# EAGLE schematic stm32_02 - Stijn (EAGLE 9.5.1)

## Sheet 1 of 4: POWER
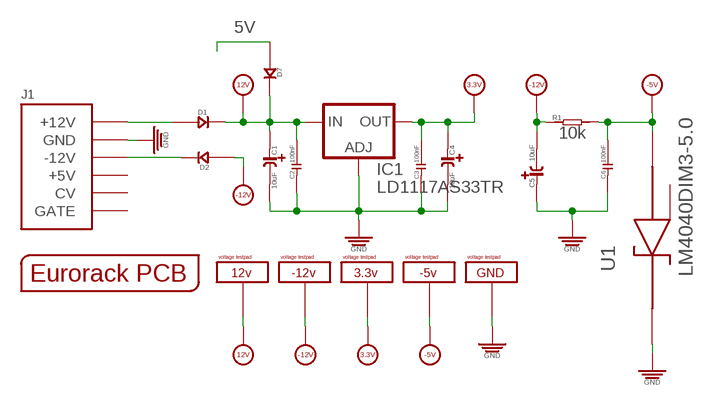
[diagram p0: schematic, sheet 1]

### Parts
C1  10uF  C-POLAR-A  [CASE-A_3216]
C2  100nF  C-0603  [C0603]
C3  100nF  C-0603  [C0603]
C4  10uF  C-POLAR-A  [CASE-A_3216]
C5  10uF  C-POLAR-A  [CASE-A_3216]
C6  100nF  C-0603  [C0603]
D1  D-SMA  [DO-214AC]
D2  D-SMA  [DO-214AC]
D7  D-SMA  [DO-214AC]
IC1  LD1117AS33TR  [SOT223]
J1  POWERSHROUDED  [POWER_16_SHROUDED]
PCB1  EURORACK_PCB12HP  [EURORACK12HPPCB]
R1  10k  R-0603  [R0603]
U1  LM4040DIM3-5.0  [SOT95P237X112-3N]
U$7  VOLTAGETESTPAD  [POWERTESTPAD]
U$8  VOLTAGETESTPAD  [POWERTESTPAD]
U$37  VOLTAGETESTPAD  [POWERTESTPAD]
U$38  VOLTAGETESTPAD  [POWERTESTPAD]
U$43  VOLTAGETESTPAD  [POWERTESTPAD]

### Nets
3.3V [POWER]: C3.2 C4.+ IC1.2(OUT) IC1.4(OUT) U$37.P$1(VOLTAGE) U$37.P$2(VOLTAGE) U$37.P$3(VOLTAGE) ; also sheet 2,3,4
5V: D7.1(+) ; also sheet 2
12V [POWER]: C1.+ C2.2 D1.2(-) D7.2(-) IC1.3(IN) U$7.P$1(VOLTAGE) U$7.P$2(VOLTAGE) U$7.P$3(VOLTAGE) ; also sheet 4
-5V [POWER]: C6.2 R1.2 U1.2(ANODE) U$38.P$1(VOLTAGE) U$38.P$2(VOLTAGE) U$38.P$3(VOLTAGE) ; also sheet 3,4
-12V [POWER]: C5.- D2.1(+) R1.1 U$8.P$1(VOLTAGE) U$8.P$2(VOLTAGE) U$8.P$3(VOLTAGE) ; also sheet 4
GND [POWER]: C1.- C2.1 C3.1 C4.- C5.+ C6.1 IC1.1(ADJ) J1.3(GND) J1.4(GND) J1.5(GND) J1.6(GND) J1.7(GND) J1.8(GND) U1.1(CATHODE) U$43.P$1(VOLTAGE) U$43.P$2(VOLTAGE) U$43.P$3(VOLTAGE) ; also sheet 2,3,4
N$1: D2.2(-) J1.1(-12V) J1.2(-12V)
N$2: D1.1(+) J1.9(+12V) J1.10(+12V)
Unconnected: J1.11(+5V) J1.12(+5V) J1.13(CV) J1.14(CV) J1.15(GATE) J1.16(GATE) U1.3(NC)

## Sheet 2 of 4: STM
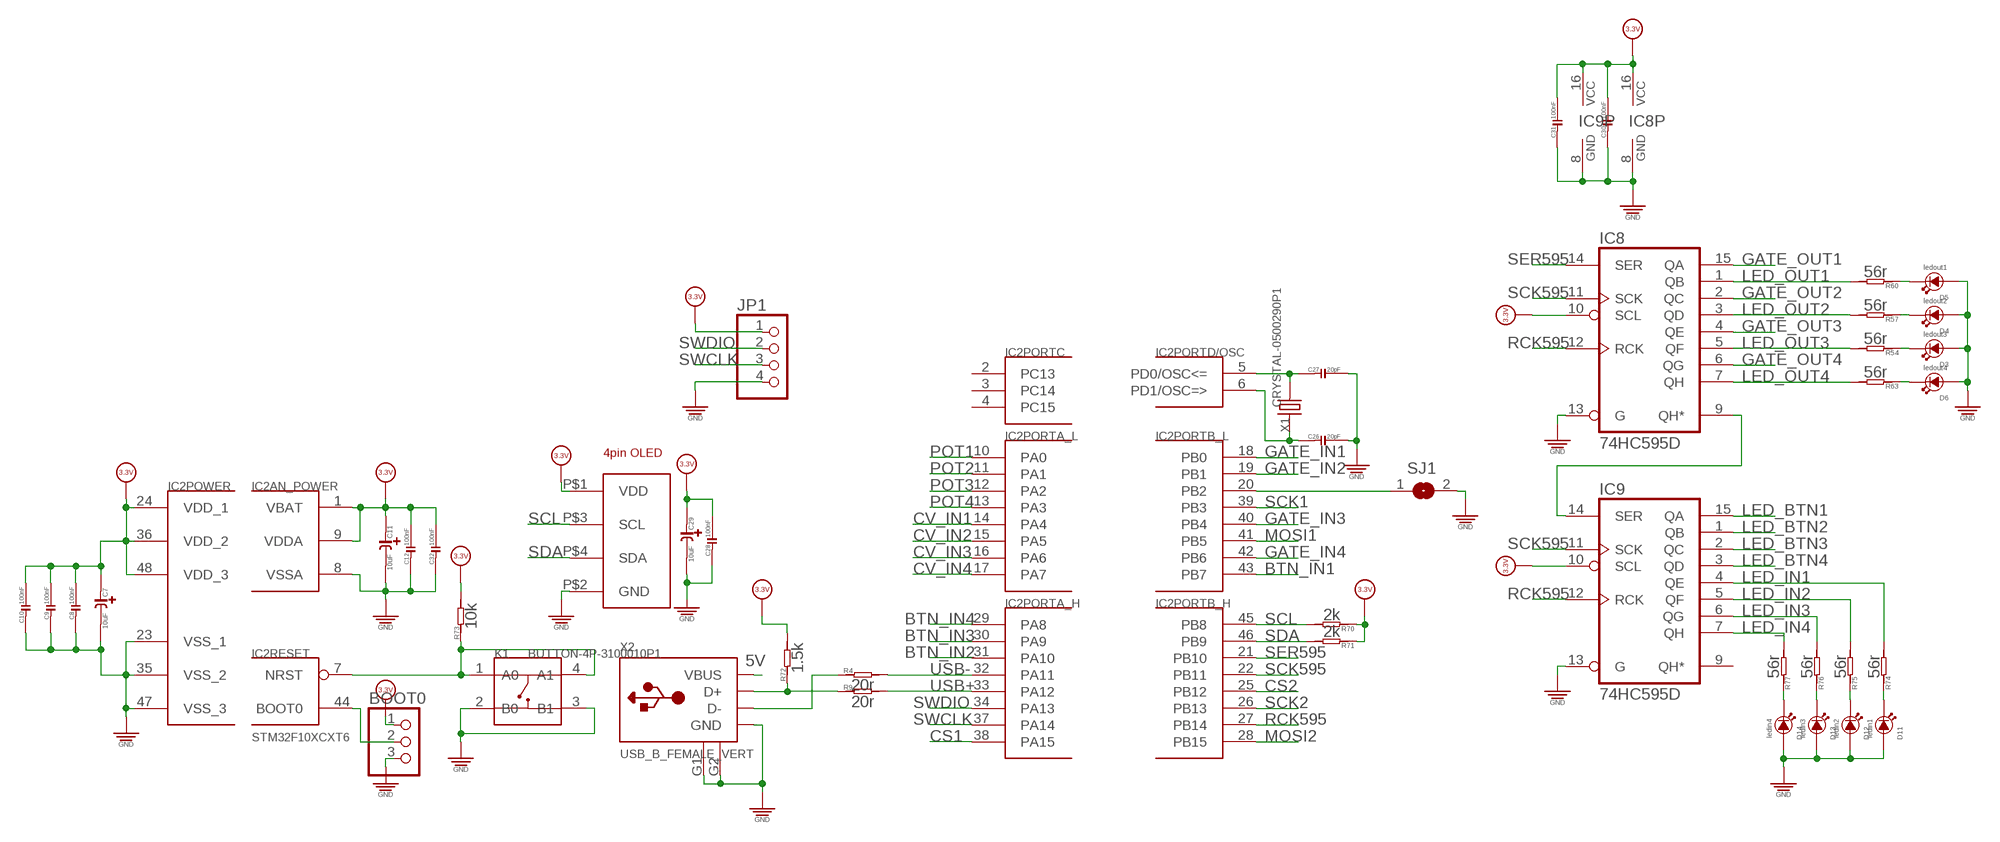
[diagram p1: schematic, sheet 2]

### Parts
BOOT0  PINHD-1X3  [1X03]
C7  10uF  C-POLAR-A  [CASE-A_3216]
C8  100nF  C-0603  [C0603]
C9  100nF  C-0603  [C0603]
C10  100nF  C-0603  [C0603]
C11  10uF  C-POLAR-A  [CASE-A_3216]
C12  100nF  C-0603  [C0603]
C26  20pF  C-0603  [C0603]
C27  20pF  C-0603  [C0603]
C28  100nF  C-0603  [C0603]
C29  10uF  C-POLAR-A  [CASE-A_3216]
C30  100nF  C-0603  [C0603]
C31  100nF  C-0603  [C0603]
C32  100nF  C-0603  [C0603]
D3  LED3MM  [3MMLED]
D4  LED3MM  [3MMLED]
D5  LED3MM  [3MMLED]
D6  LED3MM  [3MMLED]
D11  LED3MM  [3MMLED]
D12  LED3MM  [3MMLED]
D13  LED3MM  [3MMLED]
D14  LED3MM  [3MMLED]
IC2  STM32F10XCXT6  [TQFP48]
IC8  74HC595D  [SO16]
IC9  74HC595D  [SO16]
JP1  PINHD-1X4  [1X04]
K1  BUTTON-4P-3100010P1  [4P-SMD-6.0X6.0X5.0H]
R4  20r  R-0603  [R0603]
R9  20r  R-0603  [R0603]
R54  56r  R-0603  [R0603]
R57  56r  R-0603  [R0603]
R60  56r  R-0603  [R0603]
R63  56r  R-0603  [R0603]
R70  2k  R-0603  [R0603]
R71  2k  R-0603  [R0603]
R72  1.5k  R-0603  [R0603]
R73  10k  R-0603  [R0603]
R74  56r  R-0603  [R0603]
R75  56r  R-0603  [R0603]
R76  56r  R-0603  [R0603]
R77  56r  R-0603  [R0603]
SJ1  SJ  [SJ]
U$44  4PIN_OLED  [1.3_4PIN_OLED]
X1  CRYSTAL-0500290P1  [2P-SMD-5.0X3.2]
X2  USB_B_FEMALE_VERT  [USB_B_VERT]

### Nets
3.3V [POWER]: BOOT0.1 C7.+ C8.2 C9.2 C10.2 C11.+ C12.2 C28.2 C29.+ C30.2 C31.2 C32.2 IC2.1(AN_POWER:VBAT) IC2.9(AN_POWER:VDDA) IC2.24(POWER:VDD_1) IC2.36(POWER:VDD_2) IC2.48(POWER:VDD_3) IC8.10(SCL) IC8.16(VCC) IC9.10(SCL) IC9.16(VCC) JP1.1 R70.1 R71.1 R72.2 R73.2 U$44.P$1(VDD) ; also sheet 1,3,4
5V: X2.1(VBUS) ; also sheet 1
BTN_IN1: IC2.43(PORTB_L:PB7) ; also sheet 3
BTN_IN2: IC2.31(PORTA_H:PA10) ; also sheet 3
BTN_IN3: IC2.30(PORTA_H:PA9) ; also sheet 3
BTN_IN4: IC2.29(PORTA_H:PA8) ; also sheet 3
CS1: IC2.38(PORTA_H:PA15) ; also sheet 4
CS2: IC2.25(PORTB_H:PB12) ; also sheet 4
CV_IN1: IC2.14(PORTA_L:PA4) ; also sheet 3
CV_IN2: IC2.15(PORTA_L:PA5) ; also sheet 3
CV_IN3: IC2.16(PORTA_L:PA6) ; also sheet 3
CV_IN4: IC2.17(PORTA_L:PA7) ; also sheet 3
GATE_IN1: IC2.18(PORTB_L:PB0) ; also sheet 3
GATE_IN2: IC2.19(PORTB_L:PB1) ; also sheet 3
GATE_IN3: IC2.40(PORTB_L:PB4) ; also sheet 3
GATE_IN4: IC2.42(PORTB_L:PB6) ; also sheet 3
GATE_OUT1: IC8.15(QA) ; also sheet 4
GATE_OUT2: IC8.2(QC) ; also sheet 4
GATE_OUT3: IC8.4(QE) ; also sheet 4
GATE_OUT4: IC8.6(QG) ; also sheet 4
GND [POWER]: BOOT0.3 C7.- C8.1 C9.1 C10.1 C11.- C12.1 C26.2 C27.2 C28.1 C29.- C30.1 C31.1 C32.1 D3.+ D4.+ D5.+ D6.+ D11.+ D12.+ D13.+ D14.+ IC2.8(AN_POWER:VSSA) IC2.23(POWER:VSS_1) IC2.35(POWER:VSS_2) IC2.47(POWER:VSS_3) IC8.8(GND) IC8.13(G) IC9.8(GND) IC9.13(G) JP1.4 K1.2(B0) K1.3(B1) SJ1.2 U$44.P$2(GND) X2.4(GND) X2.G1(GND1) X2.G2(GND2) ; also sheet 1,3,4
LED_BTN1: IC9.15(QA) ; also sheet 3
LED_BTN2: IC9.1(QB) ; also sheet 3
LED_BTN3: IC9.2(QC) ; also sheet 3
LED_BTN4: IC9.3(QD) ; also sheet 3
LED_IN1: IC9.4(QE) R74.2
LED_IN2: IC9.5(QF) R75.2
LED_IN3: IC9.6(QG) R76.2
LED_IN4: IC9.7(QH) R77.2
LED_OUT1: IC8.1(QB) R60.2
LED_OUT2: IC8.3(QD) R57.2
LED_OUT3: IC8.5(QF) R54.2
LED_OUT4: IC8.7(QH) R63.2
MOSI1: IC2.41(PORTB_L:PB5) ; also sheet 4
MOSI2: IC2.28(PORTB_H:PB15) ; also sheet 4
N$51: D3.- R54.1
N$56: IC2.32(PORTA_H:PA11) R4.2
N$59: D6.- R63.1
N$60: IC2.33(PORTA_H:PA12) R9.2
N$63: C27.1 IC2.5(PORTD/OSC:PD0/OSC<=) X1.2
N$64: C26.1 IC2.6(PORTD/OSC:PD1/OSC=>) X1.1
N$65: D4.- R57.1
N$67: D5.- R60.1
N$77: IC2.20(PORTB_L:PB2) SJ1.1
N$78: BOOT0.2 IC2.44(RESET:BOOT0)
N$80: IC8.9(QH*) IC9.14(SER)
N$81: D11.- R74.1
N$82: D12.- R75.1
N$83: D13.- R76.1
N$84: D14.- R77.1
POT1: IC2.10(PORTA_L:PA0) ; also sheet 3
POT2: IC2.11(PORTA_L:PA1) ; also sheet 3
POT3: IC2.12(PORTA_L:PA2) ; also sheet 3
POT4: IC2.13(PORTA_L:PA3) ; also sheet 3
RCK595: IC2.27(PORTB_H:PB14) IC8.12(RCK) IC9.12(RCK)
RESET: IC2.7(RESET:NRST) K1.1(A0) K1.4(A1) R73.1
SCK1: IC2.39(PORTB_L:PB3) ; also sheet 4
SCK2: IC2.26(PORTB_H:PB13) ; also sheet 4
SCK595: IC2.22(PORTB_H:PB11) IC8.11(SCK) IC9.11(SCK)
SCL: IC2.45(PORTB_H:PB8) R70.2 U$44.P$3(SCL)
SDA: IC2.46(PORTB_H:PB9) R71.2 U$44.P$4(SDA)
SER595: IC2.21(PORTB_H:PB10) IC8.14(SER)
SWCLK: IC2.37(PORTA_H:PA14) JP1.3
SWDIO: IC2.34(PORTA_H:PA13) JP1.2
USB+: R9.1 R72.1 X2.3(D+)
USB-: R4.1 X2.2(D-)
Unconnected: IC2.2(PORTC:PC13) IC2.3(PORTC:PC14) IC2.4(PORTC:PC15) IC9.9(QH*)

## Sheet 3 of 4: INPUTS
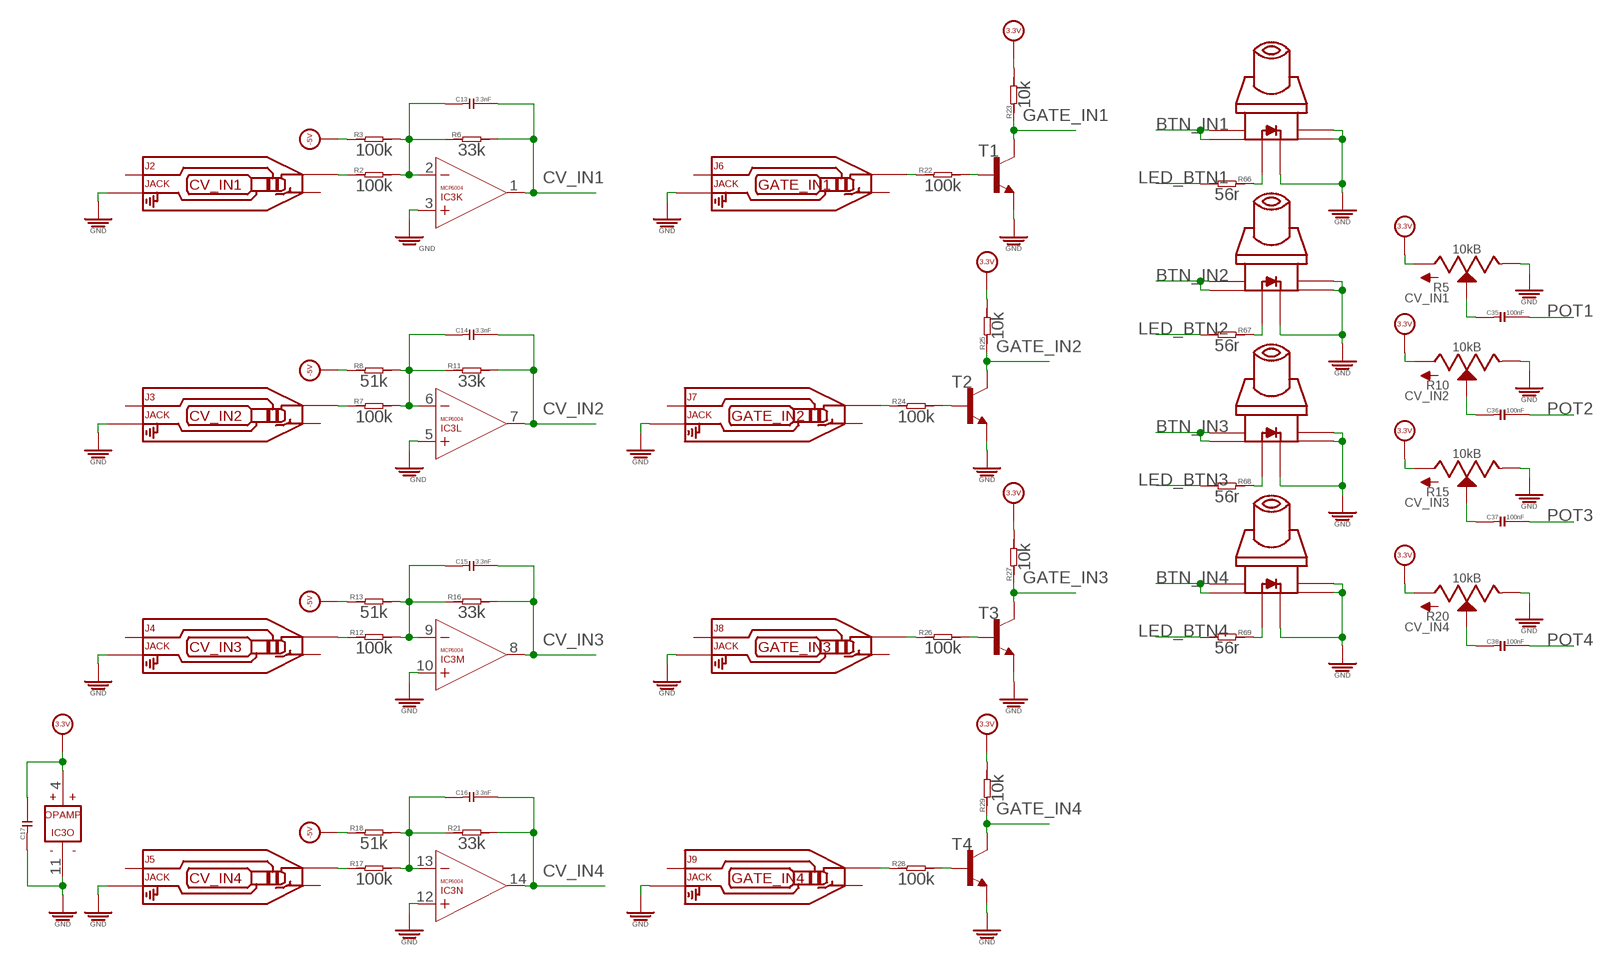
[diagram p2: schematic, sheet 3]

### Parts
C13  3.3nF  C-0603  [C0603]
C14  3.3nF  C-0603  [C0603]
C15  3.3nF  C-0603  [C0603]
C16  3.3nF  C-0603  [C0603]
C17  C-0603  [C0603]
C35  100nF  C-0603  [C0603]
C36  100nF  C-0603  [C0603]
C37  100nF  C-0603  [C0603]
C38  100nF  C-0603  [C0603]
IC3  MCP6004  [SO14]
J2  JACK  AUDIO-JACK_SMALLSYMBOLNODRILL  [3.5MM-JACK-SWITCH-13MM-NOHOLES]
J3  JACK  AUDIO-JACK_SMALLSYMBOLNODRILL  [3.5MM-JACK-SWITCH-13MM-NOHOLES]
J4  JACK  AUDIO-JACK_SMALLSYMBOLNODRILL  [3.5MM-JACK-SWITCH-13MM-NOHOLES]
J5  JACK  AUDIO-JACK_SMALLSYMBOLNODRILL  [3.5MM-JACK-SWITCH-13MM-NOHOLES]
J6  JACK  AUDIO-JACK_SMALLSYMBOLNODRILL  [3.5MM-JACK-SWITCH-13MM-NOHOLES]
J7  JACK  AUDIO-JACK_SMALLSYMBOLNODRILL  [3.5MM-JACK-SWITCH-13MM-NOHOLES]
J8  JACK  AUDIO-JACK_SMALLSYMBOLNODRILL  [3.5MM-JACK-SWITCH-13MM-NOHOLES]
J9  JACK  AUDIO-JACK_SMALLSYMBOLNODRILL  [3.5MM-JACK-SWITCH-13MM-NOHOLES]
R2  100k  R-0603  [R0603]
R3  100k  R-0603  [R0603]
R5  10kB  POTSQUAREHOLE_SMALLKNOB  [ALPS_POT_SQUAREHOLES]
R6  33k  R-0603  [R0603]
R7  100k  R-0603  [R0603]
R8  51k  R-0603  [R0603]
R10  10kB  POTSQUAREHOLE_SMALLKNOB  [ALPS_POT_SQUAREHOLES]
R11  33k  R-0603  [R0603]
R12  100k  R-0603  [R0603]
R13  51k  R-0603  [R0603]
R15  10kB  POTSQUAREHOLE_SMALLKNOB  [ALPS_POT_SQUAREHOLES]
R16  33k  R-0603  [R0603]
R17  100k  R-0603  [R0603]
R18  51k  R-0603  [R0603]
R20  10kB  POTSQUAREHOLE_SMALLKNOB  [ALPS_POT_SQUAREHOLES]
R21  33k  R-0603  [R0603]
R22  100k  R-0603  [R0603]
R23  10k  R-0603  [R0603]
R24  100k  R-0603  [R0603]
R25  10k  R-0603  [R0603]
R26  100k  R-0603  [R0603]
R27  10k  R-0603  [R0603]
R28  100k  R-0603  [R0603]
R29  10k  R-0603  [R0603]
R66  56r  R-0603  [R0603]
R67  56r  R-0603  [R0603]
R68  56r  R-0603  [R0603]
R69  56r  R-0603  [R0603]
S1  SWITCH_W_LED_PB6149L-X-102BLUE  [PB6149L]
S2  SWITCH_W_LED_PB6149L-X-102BLUE  [PB6149L]
S3  SWITCH_W_LED_PB6149L-X-102BLUE  [PB6149L]
S4  SWITCH_W_LED_PB6149L-X-102BLUE  [PB6149L]
T1  MMBT3904LT1-NPN-SOT23-BEC  [SOT23-BEC]
T2  MMBT3904LT1-NPN-SOT23-BEC  [SOT23-BEC]
T3  MMBT3904LT1-NPN-SOT23-BEC  [SOT23-BEC]
T4  MMBT3904LT1-NPN-SOT23-BEC  [SOT23-BEC]

### Nets
3.3V [POWER]: C17.2 IC3.4(O:V+) R5.P$3(A) R10.P$3(A) R15.P$3(A) R20.P$3(A) R23.2 R25.2 R27.2 R29.2 ; also sheet 1,2,4
-5V [POWER]: R3.1 R8.1 R13.1 R18.1 ; also sheet 1,4
BTN_IN1: S1.1 S1.2 ; also sheet 2
BTN_IN2: S2.1 S2.2 ; also sheet 2
BTN_IN3: S3.1 S3.2 ; also sheet 2
BTN_IN4: S4.1 S4.2 ; also sheet 2
CV_IN1: C13.2 IC3.1(K:OUT) R6.2 ; also sheet 2
CV_IN2: C14.2 IC3.7(L:OUT) R11.2 ; also sheet 2
CV_IN3: C15.2 IC3.8(M:OUT) R16.2 ; also sheet 2
CV_IN4: C16.2 IC3.14(N:OUT) R21.2 ; also sheet 2
GATE_IN1: R23.1 T1.C ; also sheet 2
GATE_IN2: R25.1 T2.C ; also sheet 2
GATE_IN3: R27.1 T3.C ; also sheet 2
GATE_IN4: R29.1 T4.C ; also sheet 2
GND [POWER]: C17.1 IC3.3(K:+IN) IC3.5(L:+IN) IC3.10(M:+IN) IC3.11(O:V-) IC3.12(N:+IN) J2.RING_B@1(RING) J2.RING_T@3(RING) J3.RING_B@1(RING) J3.RING_T@3(RING) J4.RING_B@1(RING) J4.RING_T@3(RING) J5.RING_B@1(RING) J5.RING_T@3(RING) J6.RING_B@1(RING) J6.RING_T@3(RING) J7.RING_B@1(RING) J7.RING_T@3(RING) J8.RING_B@1(RING) J8.RING_T@3(RING) J9.RING_B@1(RING) J9.RING_T@3(RING) R5.P$1(E) R10.P$1(E) R15.P$1(E) R20.P$1(E) S1.3 S1.4 S1.LEDNEG(NEG) S2.3 S2.4 S2.LEDNEG(NEG) S3.3 S3.4 S3.LEDNEG(NEG) S4.3 S4.4 S4.LEDNEG(NEG) T1.E T2.E T3.E T4.E ; also sheet 1,2,4
LED_BTN1: R66.2 ; also sheet 2
LED_BTN2: R67.2 ; also sheet 2
LED_BTN3: R68.2 ; also sheet 2
LED_BTN4: R69.2 ; also sheet 2
N$3: C35.1 R5.P$2(S)
N$4: J2.TIP_B@1(TIP) J2.TIP_T@3(TIP) R2.1
N$5: C13.1 IC3.2(K:-IN) R2.2 R3.2 R6.1
N$6: J7.TIP_B@1(TIP) J7.TIP_T@3(TIP) R24.1
N$7: C36.1 R10.P$2(S)
N$8: J3.TIP_B@1(TIP) J3.TIP_T@3(TIP) R7.1
N$9: C14.1 IC3.6(L:-IN) R7.2 R8.2 R11.1
N$10: R24.2 T2.B
N$11: C37.1 R15.P$2(S)
N$12: J4.TIP_B@1(TIP) J4.TIP_T@3(TIP) R12.1
N$13: C15.1 IC3.9(M:-IN) R12.2 R13.2 R16.1
N$14: J8.TIP_B@1(TIP) J8.TIP_T@3(TIP) R26.1
N$15: C38.1 R20.P$2(S)
N$16: J5.TIP_B@1(TIP) J5.TIP_T@3(TIP) R17.1
N$17: C16.1 IC3.13(N:-IN) R17.2 R18.2 R21.1
N$18: R26.2 T3.B
N$19: J6.TIP_B@1(TIP) J6.TIP_T@3(TIP) R22.1
N$20: R22.2 T1.B
N$21: J9.TIP_B@1(TIP) J9.TIP_T@3(TIP) R28.1
N$22: R28.2 T4.B
N$47: R69.1 S4.LEDPOS(POS)
N$48: R68.1 S3.LEDPOS(POS)
N$52: R67.1 S2.LEDPOS(POS)
N$55: R66.1 S1.LEDPOS(POS)
POT1: C35.2 ; also sheet 2
POT2: C36.2 ; also sheet 2
POT3: C37.2 ; also sheet 2
POT4: C38.2 ; also sheet 2
Unconnected: J2.SECOND_B@1(SECOND) J2.SECOND_T@3(SECOND) J2.SWITCH_B@1(SWITCH) J2.SWITCH_T@3(SWITCH) J3.SECOND_B@1(SECOND) J3.SECOND_T@3(SECOND) J3.SWITCH_B@1(SWITCH) J3.SWITCH_T@3(SWITCH) J4.SECOND_B@1(SECOND) J4.SECOND_T@3(SECOND) J4.SWITCH_B@1(SWITCH) J4.SWITCH_T@3(SWITCH) J5.SECOND_B@1(SECOND) J5.SECOND_T@3(SECOND) J5.SWITCH_B@1(SWITCH) J5.SWITCH_T@3(SWITCH) J6.SECOND_B@1(SECOND) J6.SECOND_T@3(SECOND) J6.SWITCH_B@1(SWITCH) J6.SWITCH_T@3(SWITCH) J7.SECOND_B@1(SECOND) J7.SECOND_T@3(SECOND) J7.SWITCH_B@1(SWITCH) J7.SWITCH_T@3(SWITCH) J8.SECOND_B@1(SECOND) J8.SECOND_T@3(SECOND) J8.SWITCH_B@1(SWITCH) J8.SWITCH_T@3(SWITCH) J9.SECOND_B@1(SECOND) J9.SECOND_T@3(SECOND) J9.SWITCH_B@1(SWITCH) J9.SWITCH_T@3(SWITCH)

## Sheet 4 of 4: OUTPUTS
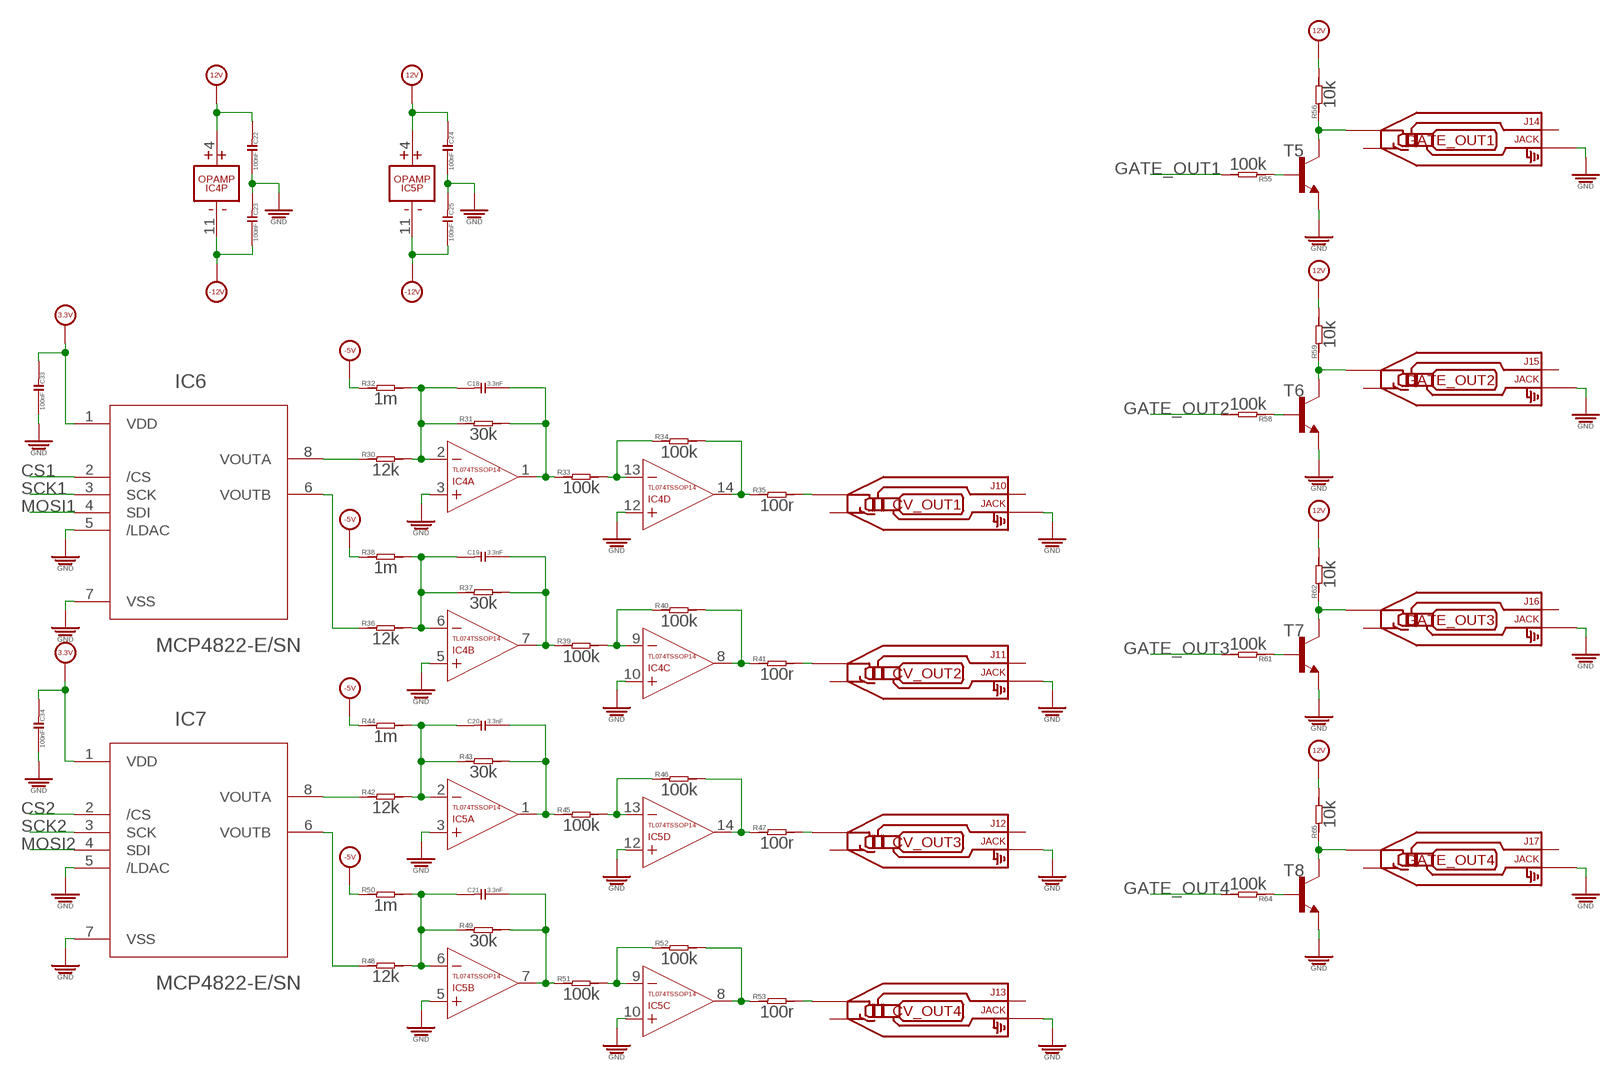
[diagram p3: schematic, sheet 4]

### Parts
C18  3.3nF  C-0603  [C0603]
C19  3.3nF  C-0603  [C0603]
C20  3.3nF  C-0603  [C0603]
C21  3.3nF  C-0603  [C0603]
C22  100nF  C-0603  [C0603]
C23  100nF  C-0603  [C0603]
C24  100nF  C-0603  [C0603]
C25  100nF  C-0603  [C0603]
C33  100nF  C-0603  [C0603]
C34  100nF  C-0603  [C0603]
IC4  TL074TSSOP14  [TSSOP14]
IC5  TL074TSSOP14  [TSSOP14]
IC6  MCP4822-E/SN  [SOIC8-N_MC]
IC7  MCP4822-E/SN  [SOIC8-N_MC]
J10  JACK  AUDIO-JACK_SMALLSYMBOLNODRILL  [3.5MM-JACK-SWITCH-13MM-NOHOLES]
J11  JACK  AUDIO-JACK_SMALLSYMBOLNODRILL  [3.5MM-JACK-SWITCH-13MM-NOHOLES]
J12  JACK  AUDIO-JACK_SMALLSYMBOLNODRILL  [3.5MM-JACK-SWITCH-13MM-NOHOLES]
J13  JACK  AUDIO-JACK_SMALLSYMBOLNODRILL  [3.5MM-JACK-SWITCH-13MM-NOHOLES]
J14  JACK  AUDIO-JACK_SMALLSYMBOLNODRILL  [3.5MM-JACK-SWITCH-13MM-NOHOLES]
J15  JACK  AUDIO-JACK_SMALLSYMBOLNODRILL  [3.5MM-JACK-SWITCH-13MM-NOHOLES]
J16  JACK  AUDIO-JACK_SMALLSYMBOLNODRILL  [3.5MM-JACK-SWITCH-13MM-NOHOLES]
J17  JACK  AUDIO-JACK_SMALLSYMBOLNODRILL  [3.5MM-JACK-SWITCH-13MM-NOHOLES]
R30  12k  R-0603  [R0603]
R31  30k  R-0603  [R0603]
R32  1m  R-0603  [R0603]
R33  100k  R-0603  [R0603]
R34  100k  R-0603  [R0603]
R35  100r  R-0603  [R0603]
R36  12k  R-0603  [R0603]
R37  30k  R-0603  [R0603]
R38  1m  R-0603  [R0603]
R39  100k  R-0603  [R0603]
R40  100k  R-0603  [R0603]
R41  100r  R-0603  [R0603]
R42  12k  R-0603  [R0603]
R43  30k  R-0603  [R0603]
R44  1m  R-0603  [R0603]
R45  100k  R-0603  [R0603]
R46  100k  R-0603  [R0603]
R47  100r  R-0603  [R0603]
R48  12k  R-0603  [R0603]
R49  30k  R-0603  [R0603]
R50  1m  R-0603  [R0603]
R51  100k  R-0603  [R0603]
R52  100k  R-0603  [R0603]
R53  100r  R-0603  [R0603]
R55  100k  R-0603  [R0603]
R56  10k  R-0603  [R0603]
R58  100k  R-0603  [R0603]
R59  10k  R-0603  [R0603]
R61  100k  R-0603  [R0603]
R62  10k  R-0603  [R0603]
R64  100k  R-0603  [R0603]
R65  10k  R-0603  [R0603]
T5  MMBT3904LT1-NPN-SOT23-BEC  [SOT23-BEC]
T6  MMBT3904LT1-NPN-SOT23-BEC  [SOT23-BEC]
T7  MMBT3904LT1-NPN-SOT23-BEC  [SOT23-BEC]
T8  MMBT3904LT1-NPN-SOT23-BEC  [SOT23-BEC]

### Nets
3.3V [POWER]: C33.1 C34.1 IC6.1(VDD) IC7.1(VDD) ; also sheet 1,2,3
12V [POWER]: C22.1 C24.1 IC4.4(P:V+) IC5.4(P:V+) R56.2 R59.2 R62.2 R65.2 ; also sheet 1
-5V [POWER]: R32.1 R38.1 R44.1 R50.1 ; also sheet 1,3
-12V [POWER]: C23.2 C25.2 IC4.11(P:V-) IC5.11(P:V-) ; also sheet 1
CS1: IC6.2(/CS) ; also sheet 2
CS2: IC7.2(/CS) ; also sheet 2
GATE_OUT1: R55.2 ; also sheet 2
GATE_OUT2: R58.2 ; also sheet 2
GATE_OUT3: R61.2 ; also sheet 2
GATE_OUT4: R64.2 ; also sheet 2
GND [POWER]: C22.2 C23.1 C24.2 C25.1 C33.2 C34.2 IC4.3(A:+IN) IC4.5(B:+IN) IC4.10(C:+IN) IC4.12(D:+IN) IC5.3(A:+IN) IC5.5(B:+IN) IC5.10(C:+IN) IC5.12(D:+IN) IC6.5(/LDAC) IC6.7(VSS) IC7.5(/LDAC) IC7.7(VSS) J10.RING_B@1(RING) J10.RING_T@3(RING) J11.RING_B@1(RING) J11.RING_T@3(RING) J12.RING_B@1(RING) J12.RING_T@3(RING) J13.RING_B@1(RING) J13.RING_T@3(RING) J14.RING_B@1(RING) J14.RING_T@3(RING) J15.RING_B@1(RING) J15.RING_T@3(RING) J16.RING_B@1(RING) J16.RING_T@3(RING) J17.RING_B@1(RING) J17.RING_T@3(RING) T5.E T6.E T7.E T8.E ; also sheet 1,2,3
MOSI1: IC6.4(SDI) ; also sheet 2
MOSI2: IC7.4(SDI) ; also sheet 2
N$23: C18.1 IC4.2(A:-IN) R30.2 R31.1 R32.2
N$24: C18.2 IC4.1(A:OUT) R31.2 R33.1
N$25: J10.TIP_B@1(TIP) J10.TIP_T@3(TIP) R35.2
N$26: IC4.13(D:-IN) R33.2 R34.1
N$27: IC4.14(D:OUT) R34.2 R35.1
N$28: IC6.8(VOUTA) R30.1
N$29: C19.1 IC4.6(B:-IN) R36.2 R37.1 R38.2
N$30: C19.2 IC4.7(B:OUT) R37.2 R39.1
N$31: IC4.9(C:-IN) R39.2 R40.1
N$32: IC4.8(C:OUT) R40.2 R41.1
N$33: IC6.6(VOUTB) R36.1
N$34: J11.TIP_B@1(TIP) J11.TIP_T@3(TIP) R41.2
N$35: C20.1 IC5.2(A:-IN) R42.2 R43.1 R44.2
N$36: C20.2 IC5.1(A:OUT) R43.2 R45.1
N$37: IC5.13(D:-IN) R45.2 R46.1
N$38: IC5.14(D:OUT) R46.2 R47.1
N$39: IC7.8(VOUTA) R42.1
N$40: J12.TIP_B@1(TIP) J12.TIP_T@3(TIP) R47.2
N$41: C21.1 IC5.6(B:-IN) R48.2 R49.1 R50.2
N$42: C21.2 IC5.7(B:OUT) R49.2 R51.1
N$43: IC5.9(C:-IN) R51.2 R52.1
N$44: IC5.8(C:OUT) R52.2 R53.1
N$45: IC7.6(VOUTB) R48.1
N$46: J13.TIP_B@1(TIP) J13.TIP_T@3(TIP) R53.2
N$49: R55.1 T5.B
N$50: J14.TIP_B@1(TIP) J14.TIP_T@3(TIP) R56.1 T5.C
N$53: R58.1 T6.B
N$54: J15.TIP_B@1(TIP) J15.TIP_T@3(TIP) R59.1 T6.C
N$57: R61.1 T7.B
N$58: J16.TIP_B@1(TIP) J16.TIP_T@3(TIP) R62.1 T7.C
N$61: R64.1 T8.B
N$62: J17.TIP_B@1(TIP) J17.TIP_T@3(TIP) R65.1 T8.C
SCK1: IC6.3(SCK) ; also sheet 2
SCK2: IC7.3(SCK) ; also sheet 2
Unconnected: J10.SECOND_B@1(SECOND) J10.SECOND_T@3(SECOND) J10.SWITCH_B@1(SWITCH) J10.SWITCH_T@3(SWITCH) J11.SECOND_B@1(SECOND) J11.SECOND_T@3(SECOND) J11.SWITCH_B@1(SWITCH) J11.SWITCH_T@3(SWITCH) J12.SECOND_B@1(SECOND) J12.SECOND_T@3(SECOND) J12.SWITCH_B@1(SWITCH) J12.SWITCH_T@3(SWITCH) J13.SECOND_B@1(SECOND) J13.SECOND_T@3(SECOND) J13.SWITCH_B@1(SWITCH) J13.SWITCH_T@3(SWITCH) J14.SECOND_B@1(SECOND) J14.SECOND_T@3(SECOND) J14.SWITCH_B@1(SWITCH) J14.SWITCH_T@3(SWITCH) J15.SECOND_B@1(SECOND) J15.SECOND_T@3(SECOND) J15.SWITCH_B@1(SWITCH) J15.SWITCH_T@3(SWITCH) J16.SECOND_B@1(SECOND) J16.SECOND_T@3(SECOND) J16.SWITCH_B@1(SWITCH) J16.SWITCH_T@3(SWITCH) J17.SECOND_B@1(SECOND) J17.SECOND_T@3(SECOND) J17.SWITCH_B@1(SWITCH) J17.SWITCH_T@3(SWITCH)

## Library data of the parts
BOOT0 = pinhead:PINHD-1X3: PIN HEADER
C1 C4 C5 C7 C11 C29 = EurorackModularParts:C-POLAR*
C2 C3 C6 C8-C10 C12-C28 C30-C38 = OPL:C*
D1 D2 D7 = OPL:D*: DIODE
D3 = EurorackModularParts:LED*: LED; DESC: ledout3
D4 = EurorackModularParts:LED*: LED; DESC: ledout2
D5 = EurorackModularParts:LED*: LED; DESC: ledout1
D6 = EurorackModularParts:LED*: LED; DESC: ledout4
D11 = EurorackModularParts:LED*: LED; DESC: ledin1
D12 = EurorackModularParts:LED*: LED; DESC: ledin2
D13 = EurorackModularParts:LED*: LED; DESC: ledin3
D14 = EurorackModularParts:LED*: LED; DESC: ledin4
IC1 = ld-components:LD1117A?*: Low drop fixed and adjustable positive voltage regulators 1 A Source: http://www.st.com/stonline/products/literature/ds/7194/ld1117axx.pdf
IC2 = stm32:STM32F10XCXT6: ST STM32F101/103 48pin LQFP
IC3 = EurorackModularParts:MCP6004
IC4 IC5 = EurorackModularParts:TL074: OP AMP
IC6 IC7 = FarnellThings:MCP4822-E/SN: 12 Bit DAC; DESCRIPTION: 12 Bit DAC; MPN: MCP4822-E/SN; OC_FARNELL: 1439414; OC_NEWARK: 31K2975; PACKAGE: SOIC-8; SUPPLIER: Microchip
IC8 IC9 = 74xx-eu:74*595: 8-bit SHIFT REGISTER, output latch
J1 = EurorackModularParts:POWER
J2 = EurorackModularParts:AUDIO-JACK_SMALLSYMBOL: Switching Mono 3.5mm Audio Jack from Erthenvar.; DESC: CV_IN1
J3 = EurorackModularParts:AUDIO-JACK_SMALLSYMBOL: Switching Mono 3.5mm Audio Jack from Erthenvar.; DESC: CV_IN2
J4 = EurorackModularParts:AUDIO-JACK_SMALLSYMBOL: Switching Mono 3.5mm Audio Jack from Erthenvar.; DESC: CV_IN3
J5 = EurorackModularParts:AUDIO-JACK_SMALLSYMBOL: Switching Mono 3.5mm Audio Jack from Erthenvar.; DESC: CV_IN4
J6 = EurorackModularParts:AUDIO-JACK_SMALLSYMBOL: Switching Mono 3.5mm Audio Jack from Erthenvar.; DESC: GATE_IN1
J7 = EurorackModularParts:AUDIO-JACK_SMALLSYMBOL: Switching Mono 3.5mm Audio Jack from Erthenvar.; DESC: GATE_IN2
J8 = EurorackModularParts:AUDIO-JACK_SMALLSYMBOL: Switching Mono 3.5mm Audio Jack from Erthenvar.; DESC: GATE_IN3
J9 = EurorackModularParts:AUDIO-JACK_SMALLSYMBOL: Switching Mono 3.5mm Audio Jack from Erthenvar.; DESC: GATE_IN4
J10 = EurorackModularParts:AUDIO-JACK_SMALLSYMBOL: Switching Mono 3.5mm Audio Jack from Erthenvar.; DESC: CV_OUT1
J11 = EurorackModularParts:AUDIO-JACK_SMALLSYMBOL: Switching Mono 3.5mm Audio Jack from Erthenvar.; DESC: CV_OUT2
J12 = EurorackModularParts:AUDIO-JACK_SMALLSYMBOL: Switching Mono 3.5mm Audio Jack from Erthenvar.; DESC: CV_OUT3
J13 = EurorackModularParts:AUDIO-JACK_SMALLSYMBOL: Switching Mono 3.5mm Audio Jack from Erthenvar.; DESC: CV_OUT4
J14 = EurorackModularParts:AUDIO-JACK_SMALLSYMBOL: Switching Mono 3.5mm Audio Jack from Erthenvar.; DESC: GATE_OUT1
J15 = EurorackModularParts:AUDIO-JACK_SMALLSYMBOL: Switching Mono 3.5mm Audio Jack from Erthenvar.; DESC: GATE_OUT2
J16 = EurorackModularParts:AUDIO-JACK_SMALLSYMBOL: Switching Mono 3.5mm Audio Jack from Erthenvar.; DESC: GATE_OUT3
J17 = EurorackModularParts:AUDIO-JACK_SMALLSYMBOL: Switching Mono 3.5mm Audio Jack from Erthenvar.; DESC: GATE_OUT4
JP1 = pinhead:PINHD-1X4: PIN HEADER
K1 = zephod-components:BUTTON-4P
PCB1 = EurorackModularParts:EURORACK_PCB
R1-R4 R6-R9 R11-R13 R16-R18 R21-R77 = OPL:R*
R5 = EurorackModularParts:POT; DESC: CV_IN1
R10 = EurorackModularParts:POT; DESC: CV_IN2
R15 = EurorackModularParts:POT; DESC: CV_IN3
R20 = EurorackModularParts:POT; DESC: CV_IN4
S1-S4 = zephod-components:SWITCH_W_LED_PB6149L-X-102
SJ1 = jumper:SJ: SMD solder JUMPER
T1-T8 = transistor:*-NPN-: NPN Transistror BF959 corrected 2008.03.06
U1 = FarnellThings:LM4040DIM3-5.0: IC, Precision Micropower Shunt Voltage Reference, 5V,SOT-23-3; MPN: LM4040DIM3-5.0; OC_FARNELL: 9778330; OC_NEWARK: 97K3489; PACKAGE: SOT-23-3; SUPPLIER: TEXAS INSTRUMENTS
U$7 = FenixBase:VOLTAGETESTPAD; DESC: 12v
U$8 = FenixBase:VOLTAGETESTPAD; DESC: -12v
U$37 = FenixBase:VOLTAGETESTPAD; DESC: 3.3v
U$38 = FenixBase:VOLTAGETESTPAD; DESC: -5v
U$43 = FenixBase:VOLTAGETESTPAD; DESC: GND
U$44 = oled:4PIN_OLED
X1 = OPL:CRYSTAL*
X2 = ld-components:USB_B_FEMALE_VERT

## Net classes
0 default: width 0.203 mm
1 POWER: width 0.254 mm